# EAGLE design Control (EAGLE 6.1)
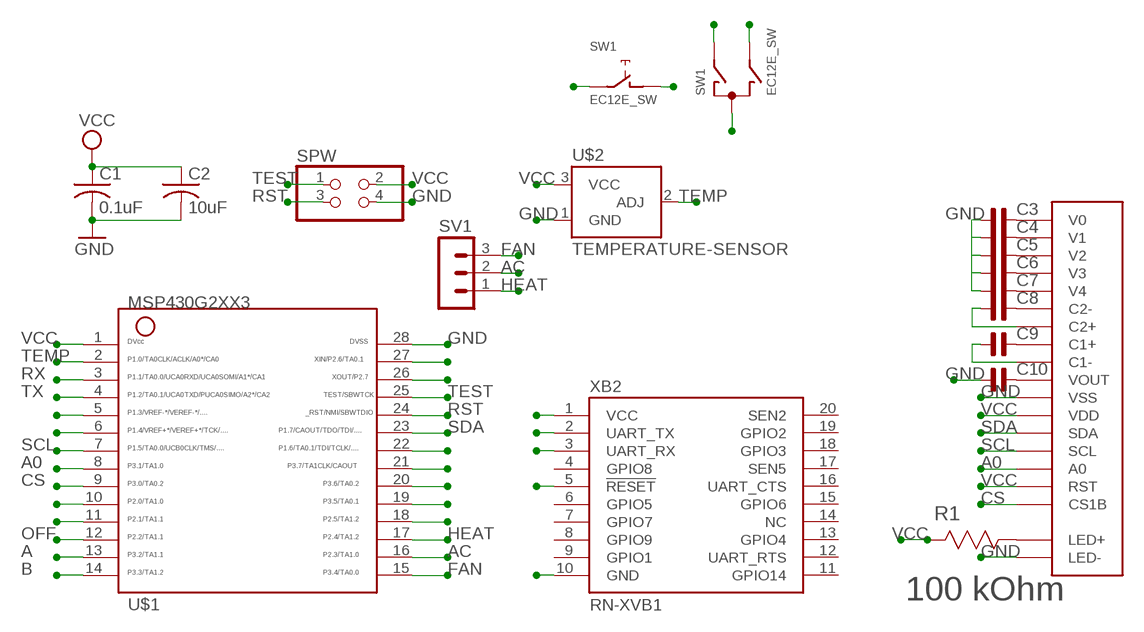
[diagram p0: schematic, sheet 1]

## Parts
C1  0.1uF  C-USC0603K  [C0603K]
C2  10uF  C-USC0603K  [C0603K]
C3  C-NP-SMD-0603  [C-0603]
C4  C-NP-SMD-0603  [C-0603]
C5  C-NP-SMD-0603  [C-0603]
C6  C-NP-SMD-0603  [C-0603]
C7  C-NP-SMD-0603  [C-0603]
C8  C-NP-SMD-0603  [C-0603]
C9  C-NP-SMD-0603  [C-0603]
C10  C-NP-SMD-0603  [C-0603]
R1  100 kOhm  ERA-3AEB104V  [RESC1608X60N]
SPW  PINHD-2X2  [2X02]
SV1  MA03-1  [MA03-1]
SW1  EC12E_SW  [ALPS_EC12E_SW]
U$1  G2XX3---PW28  [PW28]
U$2  TEMPERATURE-SENSOR  [TO-92]
U$3  NHD-C12832A1Z-FSW-FBW-3V3  [NHD-C12832A1Z-FSW-FBW-3V3]
XB2  RN-XVB1  [XBEE]

## Nets
A: SW1.B U$1.13
A0: U$1.8 U$3.15(A0)
AC: SV1.2 U$1.16
B: SW1.A U$1.14
CS: U$1.9 U$3.17(CS1B)
FAN: SV1.3 U$1.15
GND: C1.2 C2.2 C3.1 C4.1 C5.1 C6.1 C7.1 C10.1 SPW.4 SW1.C U$1.28 U$2.1(GND) U$3.11(VSS) U$3.K(LED-) XB2.10(GND)
HEAT: SV1.1 U$1.17
N$1: C3.2 U$3.1(V0)
N$2: C4.2 U$3.2(V1)
N$3: C5.2 U$3.3(V2)
N$4: C6.2 U$3.4(V3)
N$5: C7.2 U$3.5(V4)
N$6: C8.2 U$3.6(C2-)
N$7: C9.2 U$3.8(C1+)
N$8: C8.1 U$3.7(C2+)
N$9: C10.2 U$3.10(VOUT)
N$10: C9.1 U$3.9(C1-)
N$11: R1.1(R1) U$3.A(LED+)
OFF: SW1.E U$1.12
P1_3: U$1.5
P1_4: U$1.6
P1_6: U$1.22
P2_0: U$1.10
P2_1: U$1.11
P2_5: U$1.18
P2_6: U$1.27
P2_7: U$1.26
P3_5: U$1.19
P3_6: U$1.20
P3_7: U$1.21
RST: SPW.3 U$1.24
RX: U$1.3 XB2.2(UART_TX)
SCL: U$1.7 U$3.14(SCL)
SDA: U$1.23 U$3.13(SDA)
TEMP: U$1.2 U$2.2(ADJ)
TEST: SPW.1 U$1.25
TX: U$1.4 XB2.3(UART_RX)
VCC: C1.1 C2.1 R1.2(R2) SPW.2 SW1.D U$1.1 U$2.3(VCC) U$3.12(VDD) U$3.16(RST) XB2.1(VCC) XB2.5(!RESET)
Unconnected: SW1.GND1(G) SW1.GND2(G) XB2.4(GPIO8) XB2.6(GPIO5) XB2.7(GPIO7) XB2.8(GPIO9) XB2.9(GPIO1) XB2.11(GPIO14) XB2.12(UART_RTS) XB2.13(GPIO4) XB2.14(NC) XB2.15(GPIO6) XB2.16(UART_CTS) XB2.17(SEN5) XB2.18(GPIO3) XB2.19(GPIO2) XB2.20(SEN2)

## Library data of the parts
C1 C2 = rcl:C-US: CAPACITOR, American symbol
C3-C10 = cap-pan40:C-NP: NON-POLARIZED FILM/CHIP
R1 = Panasonic_By_element14_Batch_1:ERA-3AEB104V: RESISTOR, 0603; MPN: ERA-3AEB104V; OC_FARNELL: 1811349; OC_NEWARK: 08N2096; SUPPLIER: Panasonic; TOLERANCE: ±0.1%; WATTAGE: 0.1 W
SPW = pinhead:PINHD-2X2: PIN HEADER
SV1 = con-lstb:MA03-1: PIN HEADER; OC_FARNELL: unknown; OC_NEWARK: unknown
SW1 = switch-alps:EC12E_SW: ALPS rotary Encoder EC12E series with switch; MPN: EC12E2424407; OC_FARNELL: 1520813; OC_NEWARK: 74M1068
U$1 = TI_MSP430_v16:G2XX3---PW28: MSP430G2XX1 TSSOP (PW) 28 Pin Package
U$2 = SparkFun-Sensors:TEMPERATURE-SENSOR: TO-92 temp sensor
U$3 = TylersLib:NHD-C12832A1Z-FSW-FBW-3V3
XB2 = SteveMarple:RN-XV

## Board
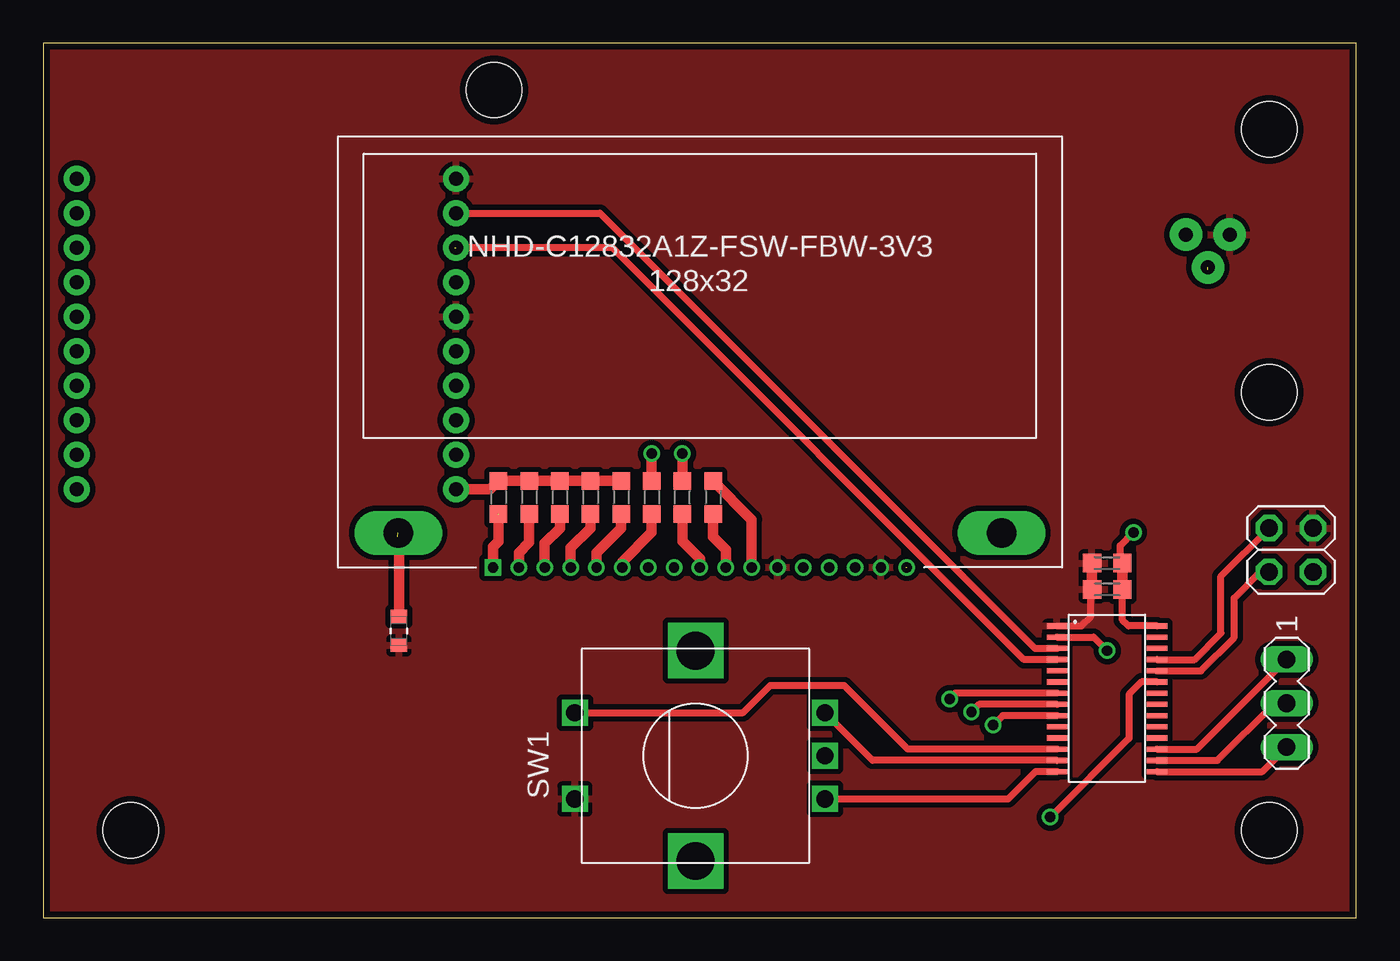
[diagram p1: board, top side]
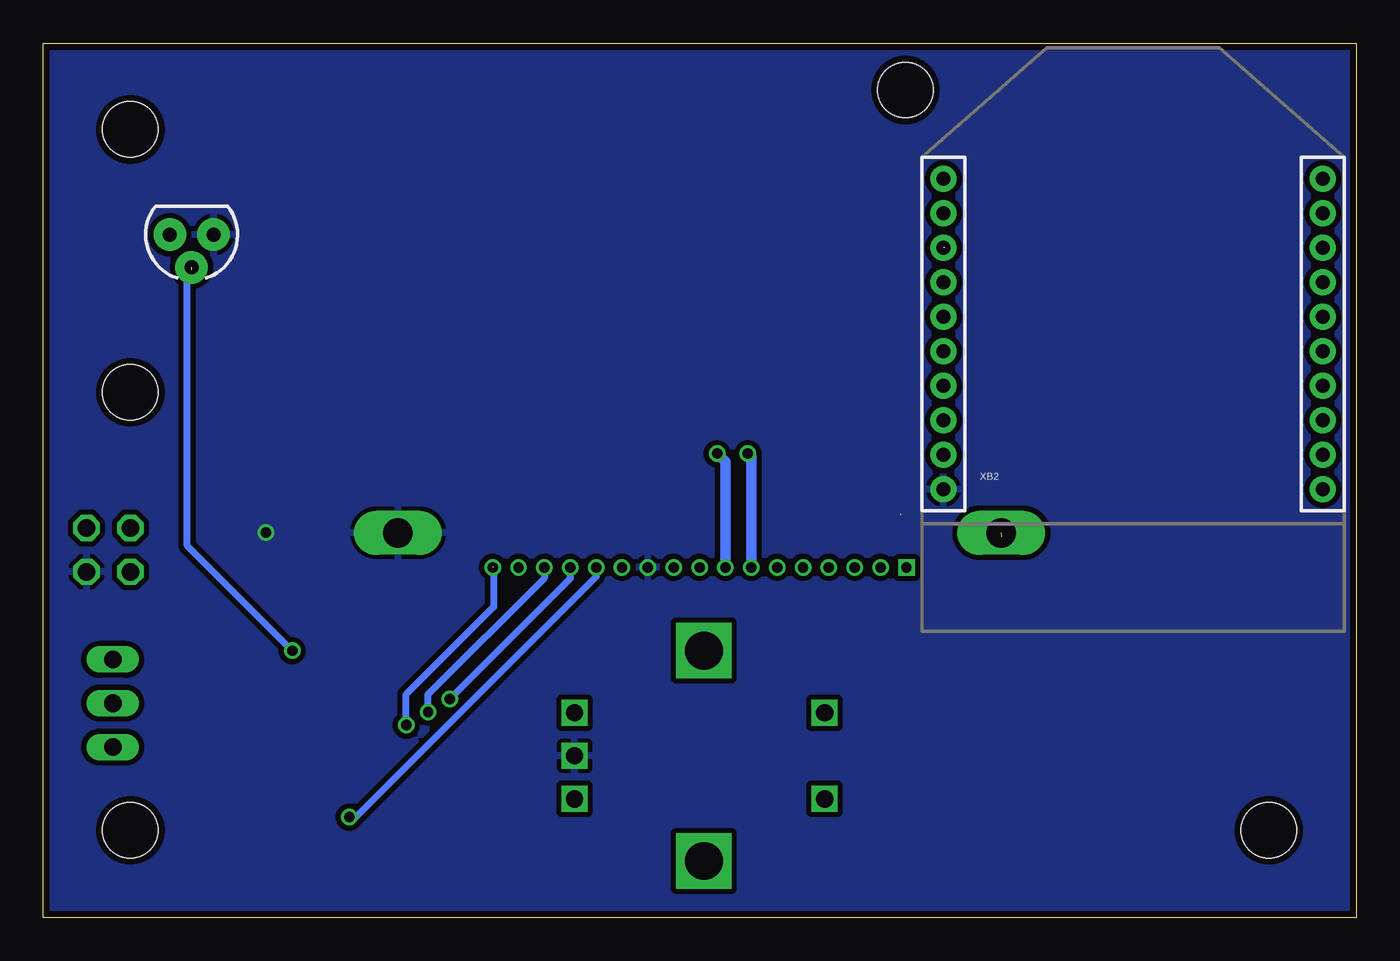
[diagram p2: board, bottom side, seen from below]

Size 76.18 x 50.72 mm. Coordinates in mm from the lower left corner, seen from the top.
Outline: 0,0 76.18,0 76.18,50.72 0,50.72 0,0
Copper layers (1*16): Top 0.0356mm / dielectric 1.5011mm / Bottom 0.0356mm
Design rules: minimum track width 6mil, minimum drill 13mil, track to track 6mil, track to pad 6mil, pad to pad 6mil, via to via 6mil, smd to smd 6mil, copper to edge 15mil, drill to drill 6mil, minimum pad ring 7mil, minimum via ring 7mil, stop-mask expansion 4mil, vias tented up to drill 0mil, thermal gap 10mil
Holes 3.2 mm at 5.08,5.08 71.12,5.08 26.16,48.01 71.12,30.48 71.12,45.72

### Footprints (pad centres in the part's own frame; a part is rotated, then mirrored left to right if it is on the bottom)
C0603K = smd 1.05 x 1.08: 1 -0.875,0; 2 0.875,0
C-0603 = smd 1.016 x 1.016: 1 -0.953,0; 2 0.953,0
RESC1608X60N = smd 0.762 x 0.94: 1 -0.838,0; 2 0.838,0
2X02 = drill 1.016 octagon: 1 -1.27,-1.27; 2 -1.27,1.27; 3 1.27,-1.27; 4 1.27,1.27
MA03-1 = drill 1.016 long: 1 -2.54,0; 2 0,0; 3 2.54,0
ALPS_EC12E_SW = drill 1 square: A -2.5,-7.5; B 2.5,-7.5; C 0,-7.5; D -2.5,7; E 2.5,7 | drill 2.2 square: GND1 -6.1,0; GND2 6.1,0
PW28 = smd 0.3 x 1.2: 1 -4.229,-2.908; 2 -3.579,-2.908; 3 -2.929,-2.908; 4 -2.279,-2.908; 5 -1.629,-2.908; 6 -0.979,-2.908; 7 -0.329,-2.908; 8 0.321,-2.908; 9 0.971,-2.908; 10 1.621,-2.908; 11 2.271,-2.908; 12 2.921,-2.908; 13 3.571,-2.908; 14 4.221,-2.908; 15 4.221,2.892; 16 3.571,2.892; 17 2.921,2.892; 18 2.271,2.892; 19 1.621,2.892; 20 0.971,2.892; 21 0.321,2.892; 22 -0.329,2.892; 23 -0.979,2.892; 24 -1.629,2.892; 25 -2.279,2.892; 26 -2.929,2.892; 27 -3.579,2.892; 28 -4.229,2.892
TO-92 = drill 0.813 pad 1.88: 1 -1.27,0; 2 0,1.905; 3 1.27,0
NHD-C12832A1Z-FSW-FBW-3V3 = drill 0.6 square: 1 -12,0 | drill 0.6: 2 -10.5,0; 3 -9,0; 4 -7.5,0; 5 -6,0; 6 -4.5,0; 7 -3,0; 8 -1.5,0; 9 0,0; 10 1.5,0; 11 3,0; 12 4.5,0; 13 6,0; 14 7.5,0; 15 9,0; 16 10.5,0; 17 12,0 | drill 1.7 long: A -17.5,2; K 17.5,2
XBEE = drill 0.8 pad 1.524: 1 -11,20; 2 -11,18; 3 -11,16; 4 -11,14; 5 -11,12; 6 -11,10; 7 -11,8; 8 -11,6; 9 -11,4; 10 -11,2; 11 11,2; 12 11,4; 13 11,6; 14 11,8; 15 11,10; 16 11,12; 17 11,14; 18 11,16; 19 11,18; 20 11,20

### Placement (x,y rotation side)
C1  61.72,19.05 0 top
C2  61.72,20.57 0 top
C3  26.42,24.38 270 top
C4  28.19,24.38 270 top
C5  29.97,24.38 270 top
C6  31.75,24.38 270 top
C7  33.53,24.38 270 top
C8  35.31,24.38 270 top
C9  37.08,24.38 90 top
C10  38.86,24.38 270 top
R1  20.64,16.64 270 top
SPW  72.39,21.34 270 top
SV1  72.14,12.45 270 top
SW1  37.85,9.4 90 top
U$1  61.72,12.7 270 top
U$2  67.56,39.62 180 bottom
U$3  38.1,20.32 0 top
XB2  12.95,22.86 0 bottom

### Tracks (layer width: path | path; a pad name or v marks a point on that pad's centre or on a via)
A
  Top 0.406: U$1.13 48.12,9.13 SW1.B
A0  (via drill 0.6)
  Top 0.406: U$1.8 54.29,12.38 v53.85,11.94
  Bottom 0.406: v53.85,11.94 53.85,12.95 47.1,19.7 U$3.15
AC
  Top 0.406: U$1.16 68.12,9.13 71.37,12.38 72.07,12.38 SV1.2
B
  Top 0.406: SW1.A 55.98,6.9 57.56,8.48 U$1.14
CS  (via drill 0.6)  (1 unrouted)
  Top 0.406: U$1.9 55.67,11.73 v55.12,11.18
  Bottom 0.406: U$3.17 | v55.12,11.18 55.12,12.95 50.04,18.03 50.04,20.32
FAN
  Top 0.406: U$1.15 70.71,8.48 SV1.3
GND  (via drill 0.6)
  Top 0.406: U$1.28 62.95,16.93 62.61,17.27 62.61,19.04 C1.2 | C2.2 62.48,20.57 62.48,21.59 v63.25,22.35
  Top 0.61: C7.1 C6.1 C5.1 C4.1 C3.1 25.94,24.86 XB2.10 | U$3.11 41.1,23.1 C10.1 | C2.2 C1.2
  pour Bottom (isolate 0.305): 0,50.8 0,0 76.2,0 76.2,50.55 76.2,50.8
HEAT
  Top 0.406: U$1.17 66.93,9.78 SV1.1
N$1  (1 unrouted)
  Top 0.61: U$3.1 26.1,21.53 26.42,21.84 26.42,23.37
N$2
  Top 0.61: C4.2 28.19,21.78 27.6,21.19 U$3.2
N$3
  Top 0.61: C5.2 29.97,22.61 29.08,21.72 29.08,20.34 U$3.3
N$4
  Top 0.61: C6.2 31.75,22.61 30.61,21.46 U$3.4
N$5
  Top 0.61: U$3.5 32.1,21.18 33.53,22.61 C7.2
N$6
  Top 0.61: U$3.6 33.6,20.65 35.31,22.35 C8.2
N$7  (via drill 0.6)
  Top 0.61: C9.2 v37.08,26.92
  Bottom 0.61: U$3.8 36.6,26.44 v37.08,26.92
N$8  (via drill 0.6)
  Top 0.61: C8.1 v35.31,26.92
  Bottom 0.61: U$3.7 35.1,26.72 v35.31,26.92
N$9
  Top 0.61: U$3.10 39.6,21.36 38.86,22.1 C10.2
N$10
  Top 0.61: U$3.9 38.1,20.83 37.08,21.84 C9.1
N$11  (1 unrouted)
  Top 0.61: R1.1 20.64,22.04 20.57,22.1
OFF
  Top 0.406: U$1.12 50.16,9.78 46.48,13.46 42.16,13.46 40.6,11.9 SW1.E
RST
  Top 0.406: U$1.24 67.16,14.33 69.09,16.26 69.09,18.54 70.61,20.07 SPW.3
RX
  Top 0.406: XB2.2 32.29,40.86 57.53,15.62 U$1.3
SCL  (via drill 0.6)
  Top 0.406: U$1.7 52.91,13.03 v52.58,12.7
  Bottom 0.406: U$3.14 45.6,19.68 v52.58,12.7
SDA  (via drill 0.6)
  Top 0.406: U$1.23 63.72,13.68 62.99,12.95 62.99,10.41 v58.42,5.84
  Bottom 0.406: U$3.13 44.1,19.78 58.04,5.84 v58.42,5.84
TEMP  (via drill 0.6)  (1 unrouted)
  Top 0.406: U$1.2 60.94,16.28 v61.72,15.49
  Bottom 0.406: v61.72,15.49 67.82,21.59 67.82,37.34 67.56,37.59
TEST
  Top 0.406: U$1.25 66.8,14.98 68.33,16.51 68.33,19.81 SPW.1
TX  (1 unrouted)
  Top 0.406: U$1.4 56.9,14.98 33.02,38.86 23.88,38.86
VCC
  Top 0.406: U$1.1 60.24,16.93 60.77,17.46 60.77,18.97 C1.1
  Top 0.61: 30.82,6.92 SW1.D | C2.1 C1.1
  pour Top (isolate 0.305): 0,50.8 0,0 76.2,0 76.2,50.8